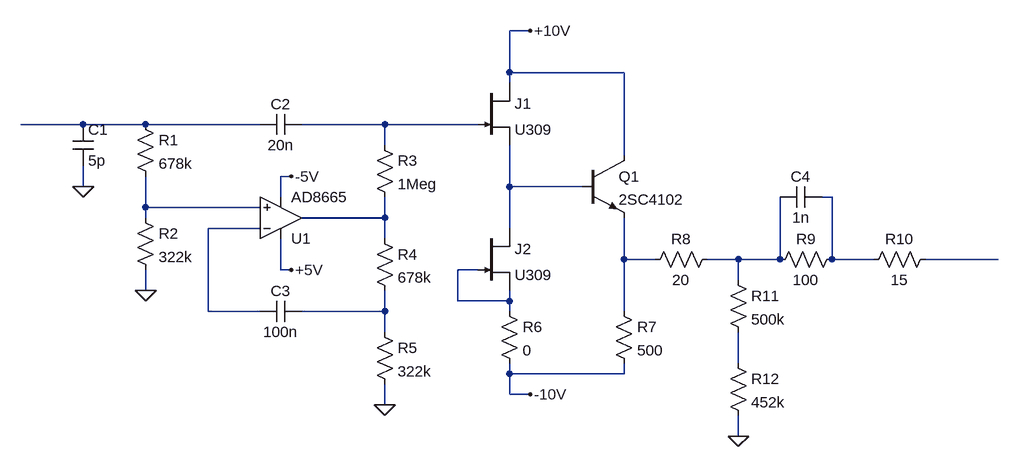
[diagram p0: schematic Draft2.asc]
Draft2.asc, the LTspice schematic file:
Version 4
SHEET 1 1460 680
WIRE 736 -16 704 -16
WIRE 704 48 704 -16
WIRE 880 48 704 48
WIRE 704 64 704 48
WIRE 48 128 -48 128
WIRE 144 128 48 128
WIRE 320 128 144 128
WIRE 512 128 384 128
WIRE 656 128 512 128
WIRE 512 160 512 128
WIRE 880 176 880 48
WIRE 368 208 352 208
WIRE 48 224 48 192
WIRE 704 224 704 160
WIRE 816 224 704 224
WIRE 352 240 352 208
WIRE 1200 240 1184 240
WIRE 144 256 144 208
WIRE 320 256 144 256
WIRE 144 272 144 256
WIRE 512 272 512 240
WIRE 512 272 384 272
WIRE 320 288 240 288
WIRE 704 288 704 224
WIRE 512 304 512 272
WIRE 880 336 880 272
WIRE 928 336 880 336
WIRE 1056 336 1008 336
WIRE 1120 336 1120 240
WIRE 1120 336 1056 336
WIRE 1200 336 1200 240
WIRE 1264 336 1200 336
WIRE 1456 336 1344 336
WIRE 352 352 352 304
WIRE 368 352 352 352
WIRE 656 352 624 352
WIRE 1056 368 1056 336
WIRE 144 384 144 352
WIRE 624 400 624 352
WIRE 704 400 704 384
WIRE 704 400 624 400
WIRE 240 416 240 288
WIRE 320 416 240 416
WIRE 512 416 512 384
WIRE 512 416 384 416
WIRE 704 416 704 400
WIRE 880 416 880 336
WIRE 512 448 512 416
WIRE 1056 496 1056 448
WIRE 704 512 704 496
WIRE 880 512 880 496
WIRE 880 512 704 512
WIRE 704 544 704 512
WIRE 736 544 704 544
WIRE 512 560 512 528
WIRE 1056 608 1056 576
FLAG 144 384 0
FLAG 48 224 0
FLAG 368 208 -5V
FLAG 368 352 +5V
FLAG 512 560 0
FLAG 736 -16 +10V
FLAG 736 544 -10V
FLAG 1056 608 0
SYMBOL cap 32 128 R0
SYMATTR InstName C1
SYMATTR Value 5p
SYMBOL res 128 112 R0
SYMATTR InstName R1
SYMATTR Value 678k
SYMBOL res 128 256 R0
SYMATTR InstName R2
SYMATTR Value 322k
SYMBOL cap 320 112 M90
WINDOW 0 0 32 VBottom 2
WINDOW 3 32 32 VTop 2
SYMATTR InstName C2
SYMATTR Value 20n
SYMBOL Opamps\\AD8665 352 336 M180
SYMATTR InstName U1
SYMBOL res 496 144 R0
SYMATTR InstName R3
SYMATTR Value 1Meg
SYMBOL res 496 288 R0
SYMATTR InstName R4
SYMATTR Value 678k
SYMBOL res 496 432 R0
SYMATTR InstName R5
SYMATTR Value 322k
SYMBOL cap 384 400 R90
WINDOW 0 0 32 VBottom 2
WINDOW 3 32 32 VTop 2
SYMATTR InstName C3
SYMATTR Value 100n
SYMBOL njf 656 64 R0
SYMATTR InstName J1
SYMATTR Value U309
SYMBOL njf 656 288 R0
SYMATTR InstName J2
SYMATTR Value U309
SYMBOL res 688 400 R0
SYMATTR InstName R6
SYMATTR Value 0
SYMBOL npn 816 176 R0
SYMATTR InstName Q1
SYMATTR Value 2SC4102
SYMBOL res 864 400 R0
SYMATTR InstName R7
SYMATTR Value 500
SYMBOL res 1024 320 R90
WINDOW 0 0 56 VBottom 2
WINDOW 3 32 56 VTop 2
SYMATTR InstName R8
SYMATTR Value 20
SYMBOL res 1216 320 R90
WINDOW 0 0 56 VBottom 2
WINDOW 3 32 56 VTop 2
SYMATTR InstName R9
SYMATTR Value 100
SYMBOL cap 1184 224 R90
WINDOW 0 0 32 VBottom 2
WINDOW 3 32 32 VTop 2
SYMATTR InstName C4
SYMATTR Value 1n
SYMBOL res 1360 320 R90
WINDOW 0 0 56 VBottom 2
WINDOW 3 32 56 VTop 2
SYMATTR InstName R10
SYMATTR Value 15
SYMBOL res 1040 352 R0
SYMATTR InstName R11
SYMATTR Value 500k
SYMBOL res 1040 480 R0
SYMATTR InstName R12
SYMATTR Value 452k

The netlist it stands for:
* Draft2.asc
C1 N001 0 5p
R1 N001 N005 678k
R2 N005 0 322k
C2 N001 N002 20n
XU1 N005 N007 +5V -5V N006 AD8665  ; pins In+ In- V+ V- OUT
R3 N002 N006 1Meg
R4 N006 N012 678k
R5 N012 0 322k
C3 N012 N007 100n
J1 +10V N002 N003 U309
J2 N003 N011 N011 U309
R6 N011 -10V 0
Q1 +10V N003 N008 0 2SC4102
R7 N008 -10V 500
R8 N009 N008 20
R9 N004 N009 100
C4 N004 N009 1n
R10 N010 N004 15
R11 N009 N013 500k
R12 N013 0 452k
.model NPN NPN
.model PNP PNP
.lib standard.bjt
.model NJF NJF
.model PJF PJF
.lib standard.jft
.backanno
.end